# Altium project UDM.PrjPcb
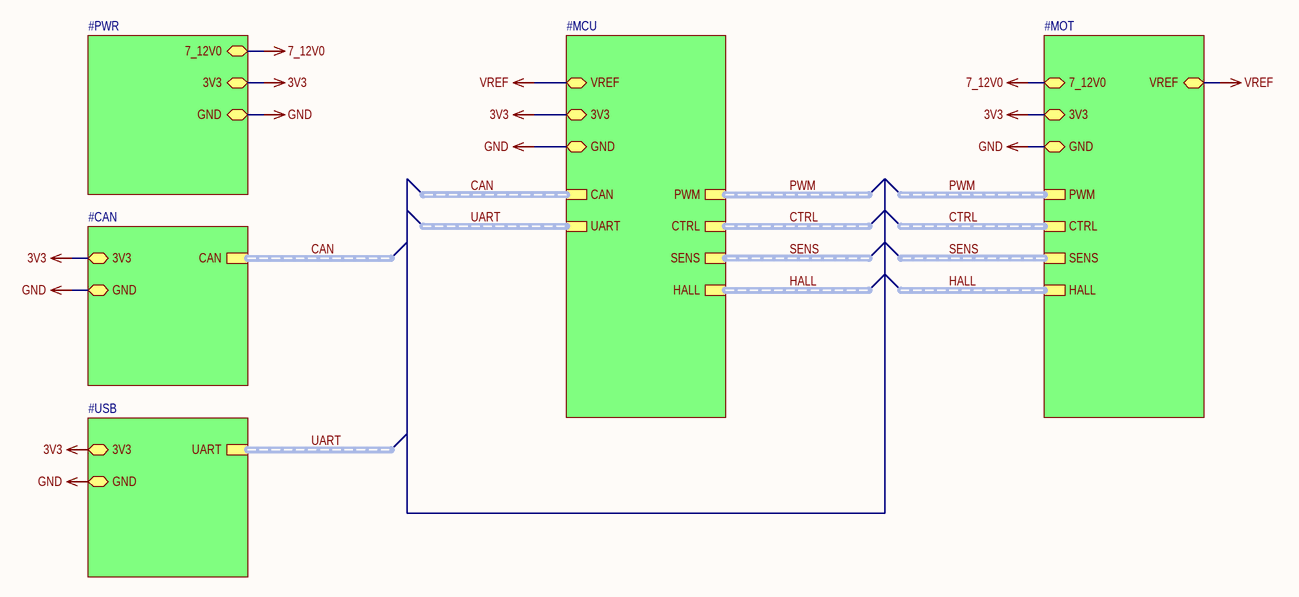
[diagram p0: top.SchDoc]
6 sheets, 102 parts. Net scope: strictly hierarchical (ports join the sheet entries above them; power ports are local).
Sheets:
  top.SchDoc
    #PWR = power.SchDoc
    #CAN = can.SchDoc
    #USB = usb.SchDoc
    #MCU = mcu.SchDoc
    #MOT = motor.SchDoc

## Sheet top.SchDoc
size A3

### Sub-sheets
#CAN = can.SchDoc: 3V3 (bidir), GND (bidir), CAN (harness UART)
#MCU = mcu.SchDoc: GND (bidir), 3V3 (bidir), CAN (harness UART), UART (harness UART), PWM (harness UART), CTRL (harness UART), SENS (harness UART), HALL (harness UART), VREF (bidir)
#MOT = motor.SchDoc: 7_12V0 (bidir), 3V3 (bidir), GND (bidir), SENS (harness UART), CTRL (harness UART), HALL (harness UART), PWM (harness UART), VREF (bidir)
#PWR = power.SchDoc: 3V3 (bidir), GND (bidir), 7_12V0 (bidir)
#USB = usb.SchDoc: 3V3 (bidir), GND (bidir), UART (harness UART)

### Nets
3V3: sheet #PWR/3V3, sheet #CAN/3V3, sheet #USB/3V3, sheet #MCU/3V3, sheet #MOT/3V3
7_12V0: sheet #PWR/7_12V0, sheet #MOT/7_12V0
GND: sheet #PWR/GND, sheet #CAN/GND, sheet #USB/GND, sheet #MCU/GND, sheet #MOT/GND
VREF: sheet #MCU/VREF, sheet #MOT/VREF

### Buses and harness runs
harness CAN = sheet #CAN/CAN
harness CAN = sheet #MCU/CAN
harness CTRL = sheet #MCU/CTRL
harness CTRL = sheet #MOT/CTRL
harness HALL = sheet #MCU/HALL
harness HALL = sheet #MOT/HALL
harness PWM = sheet #MCU/PWM
harness PWM = sheet #MOT/PWM
harness SENS = sheet #MCU/SENS
harness SENS = sheet #MOT/SENS
harness UART = sheet #MCU/UART
harness UART = sheet #USB/UART

## Sheet power.SchDoc
size A4 portrait
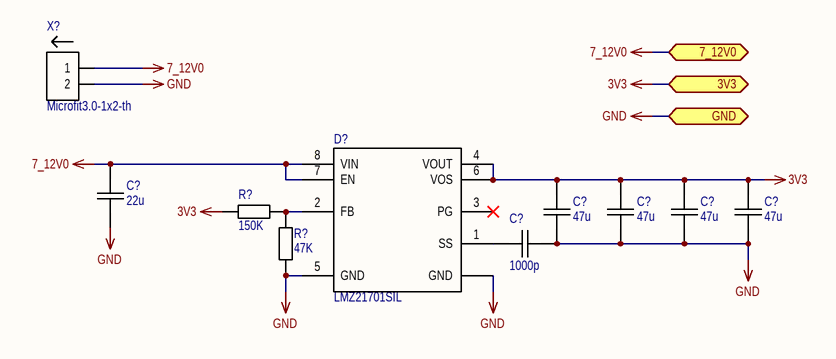
[diagram p1: power.SchDoc]

### Parts
(Parts that share a designator on the sheet are numbered #1, #2 ... from top to bottom, then left to right.)
C?#1  value 22u  [CAP-1206]  (hidden comment: CAP-22u-10%-25V-X7R-1206)
C?#2  value 47u  [CAP-0805]  (hidden comment: CAP-47u-20%-6.3V-X5R-0805)
C?#3  value 47u  [CAP-0805]  (hidden comment: CAP-47u-20%-6.3V-X5R-0805)
C?#4  value 47u  [CAP-0805]  (hidden comment: CAP-47u-20%-6.3V-X5R-0805)
C?#5  value 47u  [CAP-0805]  (hidden comment: CAP-47u-20%-6.3V-X5R-0805)
C?#6  value 1000p  [CAP-0402]  (hidden comment: CAP-1000p-5%-50V-NP0-0402)
D?#1  LMZ21701SIL  [uSIP_SIL0008E]
R?#1  value 150K  [RES-0402]  (hidden comment: RES-150K-1%-0.063-0402)
R?#2  value 47K  [RES-0402]  (hidden comment: RES-47K-1%-0.063-0402)
X?#1  Microfit3.0-1x2-th  [Microfit3.0-1x2-th]

### Ports
3V3 (bidir), 7_12V0 (bidir), GND (bidir)

### Nets
3V3: C?#2.1 C?#3.2 C?#4.2 C?#5.2 D?#1.4(VOUT) D?#1.6(VOS) R?#1.2 ; port 3V3
7_12V0: C?#1.2 D?#1.7(EN) D?#1.8(VIN) X?#1.1 ; port 7_12V0
GND: C?#1.1 C?#2.2 C?#3.1 C?#4.1 C?#5.1 C?#6.1 D?#1.5(GND) D?#1.PAD(GND) R?#2.2 X?#1.2 ; port GND
NetC?#6_2: C?#6.2 D?#1.1(SS)
NetD?#1_2: D?#1.2(FB) R?#1.1 R?#2.1

Not connected (* = marked no-connect by the designer): D?#1 3(PG)*

### Library data of the parts
C?#1 = CAP-1206: Конденсатор; Tolerance: 10; Voltage: 25; Part Number: *; Manufacturer: *; Temperature: X7R
C?#2-C?#5 = CAP-0805: Конденсатор; Tolerance: 20; Voltage: 6.3; Part Number: *; Manufacturer: *; Temperature: X5R
C?#6 = CAP-0402: Конденсатор; Tolerance: 5; Voltage: 50; Part Number: *; Manufacturer: *; Temperature: NP0
D?#1 = LMZ21701: Интегральная микросхема; Manufacturer: TI; Part Number: LMZ21701SIL
R?#1 R?#2 = RES-0402: Резистор; Tolerance: 1; Power: 0.063; Part Number: *; Manufacturer: *
X?#1 = Microfit3.0-1x2-th: Manufacturer: *; Part Number: Microfit3.0-1x2-th

## Sheet can.SchDoc
size A4 portrait
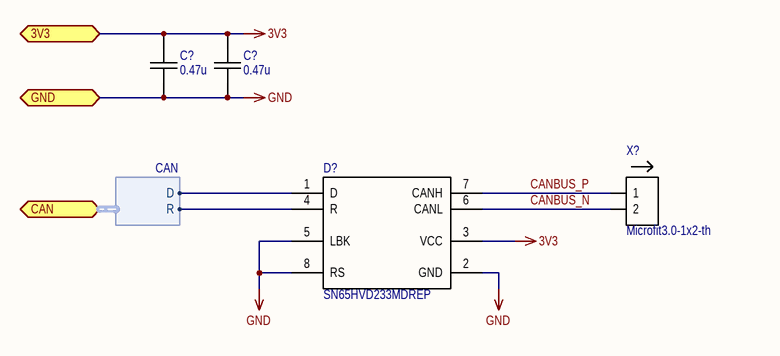
[diagram p2: can.SchDoc]

### Parts
(Parts that share a designator on the sheet are numbered #1, #2 ... from top to bottom, then left to right.)
C?#7  value 0.47u  [CAP-0402]  (hidden comment: CAP-0.47u-10%-50V-X7R-0402)
C?#8  value 0.47u  [CAP-0402]  (hidden comment: CAP-0.47u-10%-50V-X7R-0402)
D?#2  SN65HVD233MDREP  [SO-8]
X?#2  Microfit3.0-1x2-th  [Microfit3.0-1x2-th]

### Ports
3V3 (bidir), CAN (bidir, harness CAN), GND (bidir)

### Harnesses
CAN: D, R

### Nets
3V3: C?#7.2 C?#8.2 D?#2.3(VCC) ; port 3V3
GND: C?#7.1 C?#8.1 D?#2.2(GND) D?#2.5(LBK) D?#2.8(RS) ; port GND
CAN.D: D?#2.1(D) ; port CAN.D
CAN.R: D?#2.4(R) ; port CAN.R
CANBUS_N: D?#2.6(CANL) X?#2.2
CANBUS_P: D?#2.7(CANH) X?#2.1

### Library data of the parts
C?#7 C?#8 = CAP-0402: Конденсатор; Tolerance: 10; Voltage: 50; Part Number: *; Manufacturer: *; Temperature: X7R
D?#2 = SN65HVD233: Интегральная микросхема; Manufacturer: TI; Part Number: SN65HVD233MDREP
X?#2 = Microfit3.0-1x2-th: Manufacturer: *; Part Number: Microfit3.0-1x2-th

## Sheet usb.SchDoc
size A4 portrait
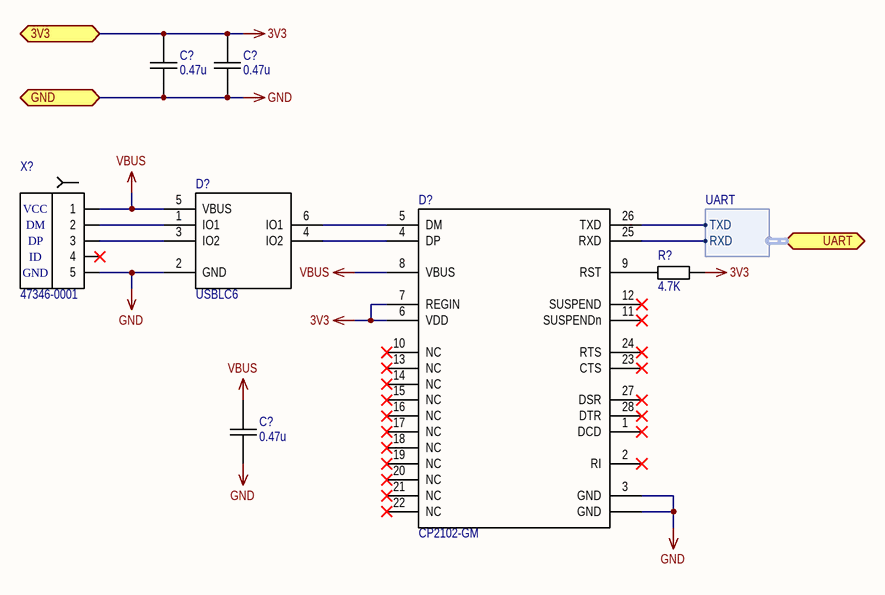
[diagram p3: usb.SchDoc]

### Parts
(Parts that share a designator on the sheet are numbered #1, #2 ... from top to bottom, then left to right.)
C?#9  value 0.47u  [CAP-0402]  (hidden comment: CAP-0.47u-10%-50V-X7R-0402)
C?#10  value 0.47u  [CAP-0402]  (hidden comment: CAP-0.47u-10%-50V-X7R-0402)
C?#11  value 0.47u  [CAP-0402]  (hidden comment: CAP-0.47u-10%-50V-X7R-0402)
D?#3  USBLC6  [SOT23-6]
D?#4  CP2102-GM  [QFN-28-5x5]
R?#3  value 4.7K  [RES-0402]  (hidden comment: RES-4.7K-1%-0.063-0402)
X?#3  47346-0001  [473460001]

### Ports
3V3 (bidir), GND (bidir), UART (bidir, harness UART)

### Harnesses
UART: TXD, RXD

### Nets
3V3: C?#9.2 C?#10.2 D?#4.6(VDD) D?#4.7(REGIN) R?#3.1 ; port 3V3
GND: C?#9.1 C?#10.1 C?#11.1 D?#3.2(GND) D?#4.3(GND) D?#4.PAD(GND) X?#3.5 ; port GND
VBUS: C?#11.2 D?#3.5(VBUS) D?#4.8(VBUS) X?#3.1
UART.RXD: D?#4.25(RXD) ; port UART.RXD
UART.TXD: D?#4.26(TXD) ; port UART.TXD
NetD?#3_1: D?#3.1(IO1) X?#3.2
NetD?#3_3: D?#3.3(IO2) X?#3.3
NetD?#3_4: D?#3.4(IO2) D?#4.4(DP)
NetD?#3_6: D?#3.6(IO1) D?#4.5(DM)
NetD?#4_9: D?#4.9(RST) R?#3.2

Not connected (* = marked no-connect by the designer): D?#4 1(DCD)* 2(RI)* 10(NC)* 11(SUSPENDn)* 12(SUSPEND)* 13(NC)* 14(NC)* 15(NC)* 16(NC)* 17(NC)* 18(NC)* 19(NC)* 20(NC)* 21(NC)* 22(NC)* 23(CTS)* 24(RTS)* 27(DSR)* 28(DTR)*; X?#3 4*

### Notes on the sheet
- (in symbol USB-Micro-B) VCC; DM; DP; ID; GND

### Library data of the parts
C?#9-C?#11 = CAP-0402: Конденсатор; Tolerance: 10; Voltage: 50; Part Number: *; Manufacturer: *; Temperature: X7R
D?#3 = USBLC6: Интегральная микросхема; Manufacturer: TI; Part Number: USBLC6
D?#4 = CP2102: Интегральная микросхема; Manufacturer: SiLabs; Part Number: CP2102-GM
R?#3 = RES-0402: Резистор; Tolerance: 1; Power: 0.063; Part Number: *; Manufacturer: *
X?#3 = USB-Micro-B: Manufacturer: Molex; Part Number: 47346-0001

## Sheet mcu.SchDoc
size A3
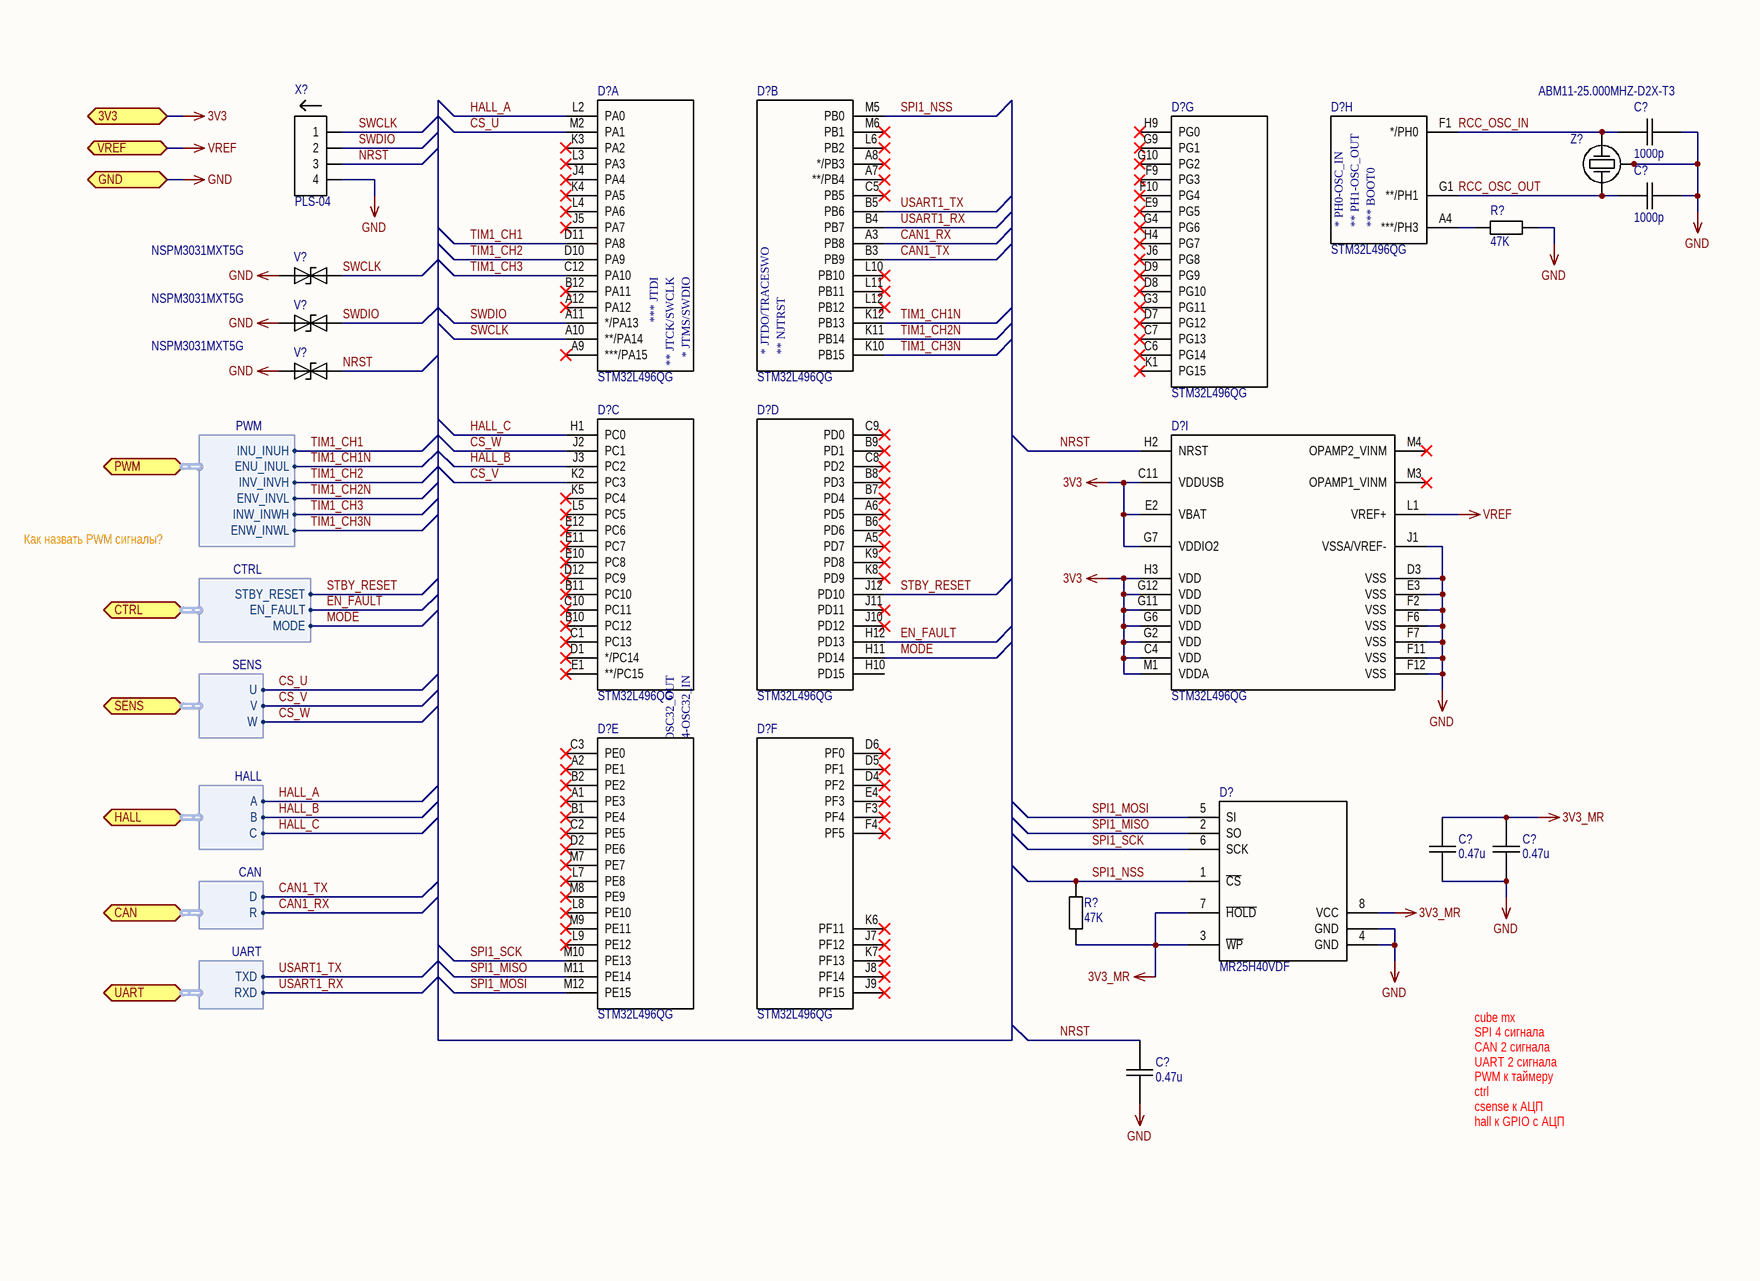
[diagram p4: mcu.SchDoc, right]

### Parts
(Parts that share a designator on the sheet are numbered #1, #2 ... from top to bottom, then left to right.)
C?#12  value 1000p  [CAP-0402]  (hidden comment: CAP-1000p-5%-50V-NP0-0402)
C?#13  value 1000p  [CAP-0402]  (hidden comment: CAP-1000p-5%-50V-NP0-0402)
C?#14  value 0.47u  [CAP-0402]  (hidden comment: CAP-0.47u-10%-50V-X7R-0402)
C?#15  value 0.47u  [CAP-0402]  (hidden comment: CAP-0.47u-10%-50V-X7R-0402)
C?#16  value 0.47u  [CAP-0402]  (hidden comment: CAP-0.47u-10%-50V-X7R-0402)
D?#5  STM32L496QG  [UFBGA132]  (part A of 9)
D?#6  STM32L496QG  [UFBGA132]  (part B of 9)
D?#7  STM32L496QG  [UFBGA132]  (part G of 9)
D?#8  STM32L496QG  [UFBGA132]  (part H of 9)
D?#9  STM32L496QG  [UFBGA132]  (part C of 9)
D?#10  STM32L496QG  [UFBGA132]  (part D of 9)
D?#11  STM32L496QG  [UFBGA132]  (part I of 9)
D?#12  STM32L496QG  [UFBGA132]  (part E of 9)
D?#13  STM32L496QG  [UFBGA132]  (part F of 9)
D?#14  MR25H40VDF  [DFN-8-5x6-SMALL_FLAG - duplicate]
R?#4  value 47K  [RES-0402]  (hidden comment: RES-47K-1%-0.063-0402)
R?#5  value 47K  [RES-0402]  (hidden comment: RES-47K-1%-0.063-0402)
V?#1  NSPM3031MXT5G  [X2DFN-2]
V?#2  NSPM3031MXT5G  [X2DFN-2]
V?#3  NSPM3031MXT5G  [X2DFN-2]
X?#4  PLS-04  [PLS-04]
Z?  ABM11-25.000MHZ-D2X-T3  [ABM11]

### Ports
3V3 (bidir), CAN (bidir, harness CAN), CTRL (bidir, harness CTRL), GND (bidir), HALL (bidir, harness HALL), PWM (bidir, harness PWM), SENS (bidir, harness SENS), UART (bidir, harness UART), VREF (bidir)

### Harnesses
CTRL: STBY_RESET, EN_FAULT, MODE
SENS: U, V, W
HALL: A, B, C
CAN: D, R
UART: TXD, RXD
PWM: INU_INUH, ENU_INUL, INV_INVH, ENV_INVL, INW_INWH, ENW_INWL

### Nets
3V3: D?#11.C4(VDD) D?#11.C11(VDDUSB) D?#11.E2(VBAT) D?#11.G2(VDD) D?#11.G6(VDD) D?#11.G7(VDDIO2) D?#11.G11(VDD) D?#11.G12(VDD) D?#11.H3(VDD) D?#11.M1(VDDA) ; port 3V3
3V3_MR: C?#14.2 C?#15.2 D?#14.3(~{WP}) D?#14.7(~{HOLD}) D?#14.8(VCC) R?#5.1
GND: C?#12.2 C?#13.2 C?#14.1 C?#15.1 C?#16.1 D?#11.D3(VSS) D?#11.E3(VSS) D?#11.F2(VSS) D?#11.F6(VSS) D?#11.F7(VSS) D?#11.F11(VSS) D?#11.F12(VSS) D?#11.J1(VSSA/VREF-) D?#14.4(GND) D?#14.PAD(GND) R?#4.2 V?#1.1 V?#2.1 V?#3.1 X?#4.4 Z?.2 Z?.4 ; port GND
VREF: D?#11.L1(VREF+) ; port VREF
CAN1_RX: D?#6.A3(PB8) ; port CAN.R  [project net CAN.R]
CAN1_TX: D?#6.B3(PB9) ; port CAN.D  [project net CAN.D]
CS_U: D?#5.M2(PA1) ; port SENS.U  [project net SENS.U]
CS_V: D?#9.K2(PC3) ; port SENS.V  [project net SENS.V]
CS_W: D?#9.J2(PC1) ; port SENS.W  [project net SENS.W]
EN_FAULT: D?#10.H12(PD13) ; port CTRL.EN_FAULT  [project net CTRL.EN_FAULT]
HALL_A: D?#5.L2(PA0) ; port HALL.A  [project net HALL.A]
HALL_B: D?#9.J3(PC2) ; port HALL.B  [project net HALL.B]
HALL_C: D?#9.H1(PC0) ; port HALL.C  [project net HALL.C]
MODE: D?#10.H11(PD14) ; port CTRL.MODE  [project net CTRL.MODE]
NRST: C?#16.2 D?#11.H2(NRST) V?#3.2 X?#4.3
RCC_OSC_IN: C?#12.1 D?#8.F1(*/PH0) Z?.3
RCC_OSC_OUT: C?#13.1 D?#8.G1(**/PH1) Z?.1
SPI1_MISO: D?#12.M11(PE14) D?#14.2(SO)
SPI1_MOSI: D?#12.M12(PE15) D?#14.5(SI)
SPI1_NSS: D?#6.M5(PB0) D?#14.1(~{CS}) R?#5.2
SPI1_SCK: D?#12.M10(PE13) D?#14.6(SCK)
STBY_RESET: D?#10.J12(PD10) ; port CTRL.STBY_RESET  [project net CTRL.STBY_RESET]
SWCLK: D?#5.A10(**/PA14) V?#1.2 X?#4.1
SWDIO: D?#5.A11(*/PA13) V?#2.2 X?#4.2
TIM1_CH1: D?#5.D11(PA8) ; port PWM.INU_INUH  [project net PWM.INU_INUH]
TIM1_CH1N: D?#6.K12(PB13) ; port PWM.ENU_INUL  [project net PWM.ENU_INUL]
TIM1_CH2: D?#5.D10(PA9) ; port PWM.INV_INVH  [project net PWM.INV_INVH]
TIM1_CH2N: D?#6.K11(PB14) ; port PWM.ENV_INVL  [project net PWM.ENV_INVL]
TIM1_CH3: D?#5.C12(PA10) ; port PWM.INW_INWH  [project net PWM.INW_INWH]
TIM1_CH3N: D?#6.K10(PB15) ; port PWM.ENW_INWL  [project net PWM.ENW_INWL]
USART1_RX: D?#6.B4(PB7) ; port UART.RXD  [project net UART.RXD]
USART1_TX: D?#6.B5(PB6) ; port UART.TXD  [project net UART.TXD]
NetD?#8_A4: D?#8.A4(***/PH3) R?#4.1

Not connected (* = marked no-connect by the designer): D?#5 A9(***/PA15)* A12(PA12)* B12(PA11)* J4(PA4)* J5(PA7)* K3(PA2)* K4(PA5)* L3(PA3)* L4(PA6)*; D?#6 A7(**/PB4)* A8(*/PB3)* C5(PB5)* L6(PB2)* L10(PB10)* L11(PB11)* L12(PB12)* M6(PB1)*; D?#7 C6(PG14)* C7(PG13)* D7(PG12)* D8(PG10)* D9(PG9)* E9(PG5)* F9(PG3)* F10(PG4)* G3(PG11)* G4(PG6)* G9(PG1)* G10(PG2)* H4(PG7)* H9(PG0)* J6(PG8)* K1(PG15)*; D?#9 B10(PC12)* B11(PC10)* C1(PC13)* C10(PC11)* D1(*/PC14)* D12(PC9)* E1(**/PC15)* E10(PC8)* E11(PC7)* E12(PC6)* K5(PC4)* L5(PC5)*; D?#10 A5(PD7)* A6(PD5)* B6(PD6)* B7(PD4)* B8(PD3)* B9(PD1)* C8(PD2)* C9(PD0)* H10(PD15) J10(PD12)* J11(PD11)* K8(PD9)* K9(PD8)*; D?#11 M3(OPAMP1_VINM)* M4(OPAMP2_VINM)*; D?#12 A1(PE3)* A2(PE1)* B1(PE4)* B2(PE2)* C2(PE5)* C3(PE0)* D2(PE6)* L7(PE8)* L8(PE10)* L9(PE12)* M7(PE7)* M8(PE9)* M9(PE11)*; D?#13 D4(PF2)* D5(PF1)* D6(PF0)* E4(PF3)* F3(PF4)* F4(PF5)* J7(PF12)* J8(PF14)* J9(PF15)* K6(PF11)* K7(PF13)*

### Notes on the sheet
- Как назвать PWM сигналы?
- cube mx
  SPI 4 сигнала
  CAN 2 сигнала
  UART 2 сигнала
  PWM к таймеру
  ctrl
  csense к АЦП
  hall к GPIO с АЦП
- (in symbol STM32L496QG, part A) *** JTDI; ** JTCK/SWCLK; * JTMS/SWDIO
- (in symbol STM32L496QG, part B) * JTDO/TRACESWO; ** NJTRST
- (in symbol STM32L496QG, part C) ** PC15-OSC32_OUT; * PC14-OSC32_IN
- (in symbol STM32L496QG, part H) * PH0-OSC_IN; ** PH1-OSC_OUT; *** BOOT0

### Library data of the parts
C?#12 C?#13 = CAP-0402: Конденсатор; Tolerance: 5; Voltage: 50; Part Number: *; Manufacturer: *; Temperature: NP0
C?#14-C?#16 = CAP-0402: Конденсатор; Tolerance: 10; Voltage: 50; Part Number: *; Manufacturer: *; Temperature: X7R
D?#5-D?#13 = STM32L496QG: Интегральная микросхема; Manufacturer: ST; Part Number: STM32L496QG
D?#14 = MR25H40: Интегральная микросхема, SPI MRAM; Manufacturer: Everspin; Part Number: MR25H40VDF
R?#4 R?#5 = RES-0402: Резистор; Tolerance: 1; Power: 0.063; Part Number: *; Manufacturer: *
V?#1-V?#3 = NSPM3031: Диод подавления ESD; Manufacturer: *; Tolerance: *; Power: *; Part Number: NSPM3031MXT5G
Z? = ABM11-25MHZ: Резонатор кварцевый; Value: *; Manufacturer: *; Tolerance: *; Part Number: ABM11-25.000MHZ-D2X-T3
X?#4 = PLS-04: Manufacturer: *; Part Number: PLS-04

## Sheet motor.SchDoc
size A3
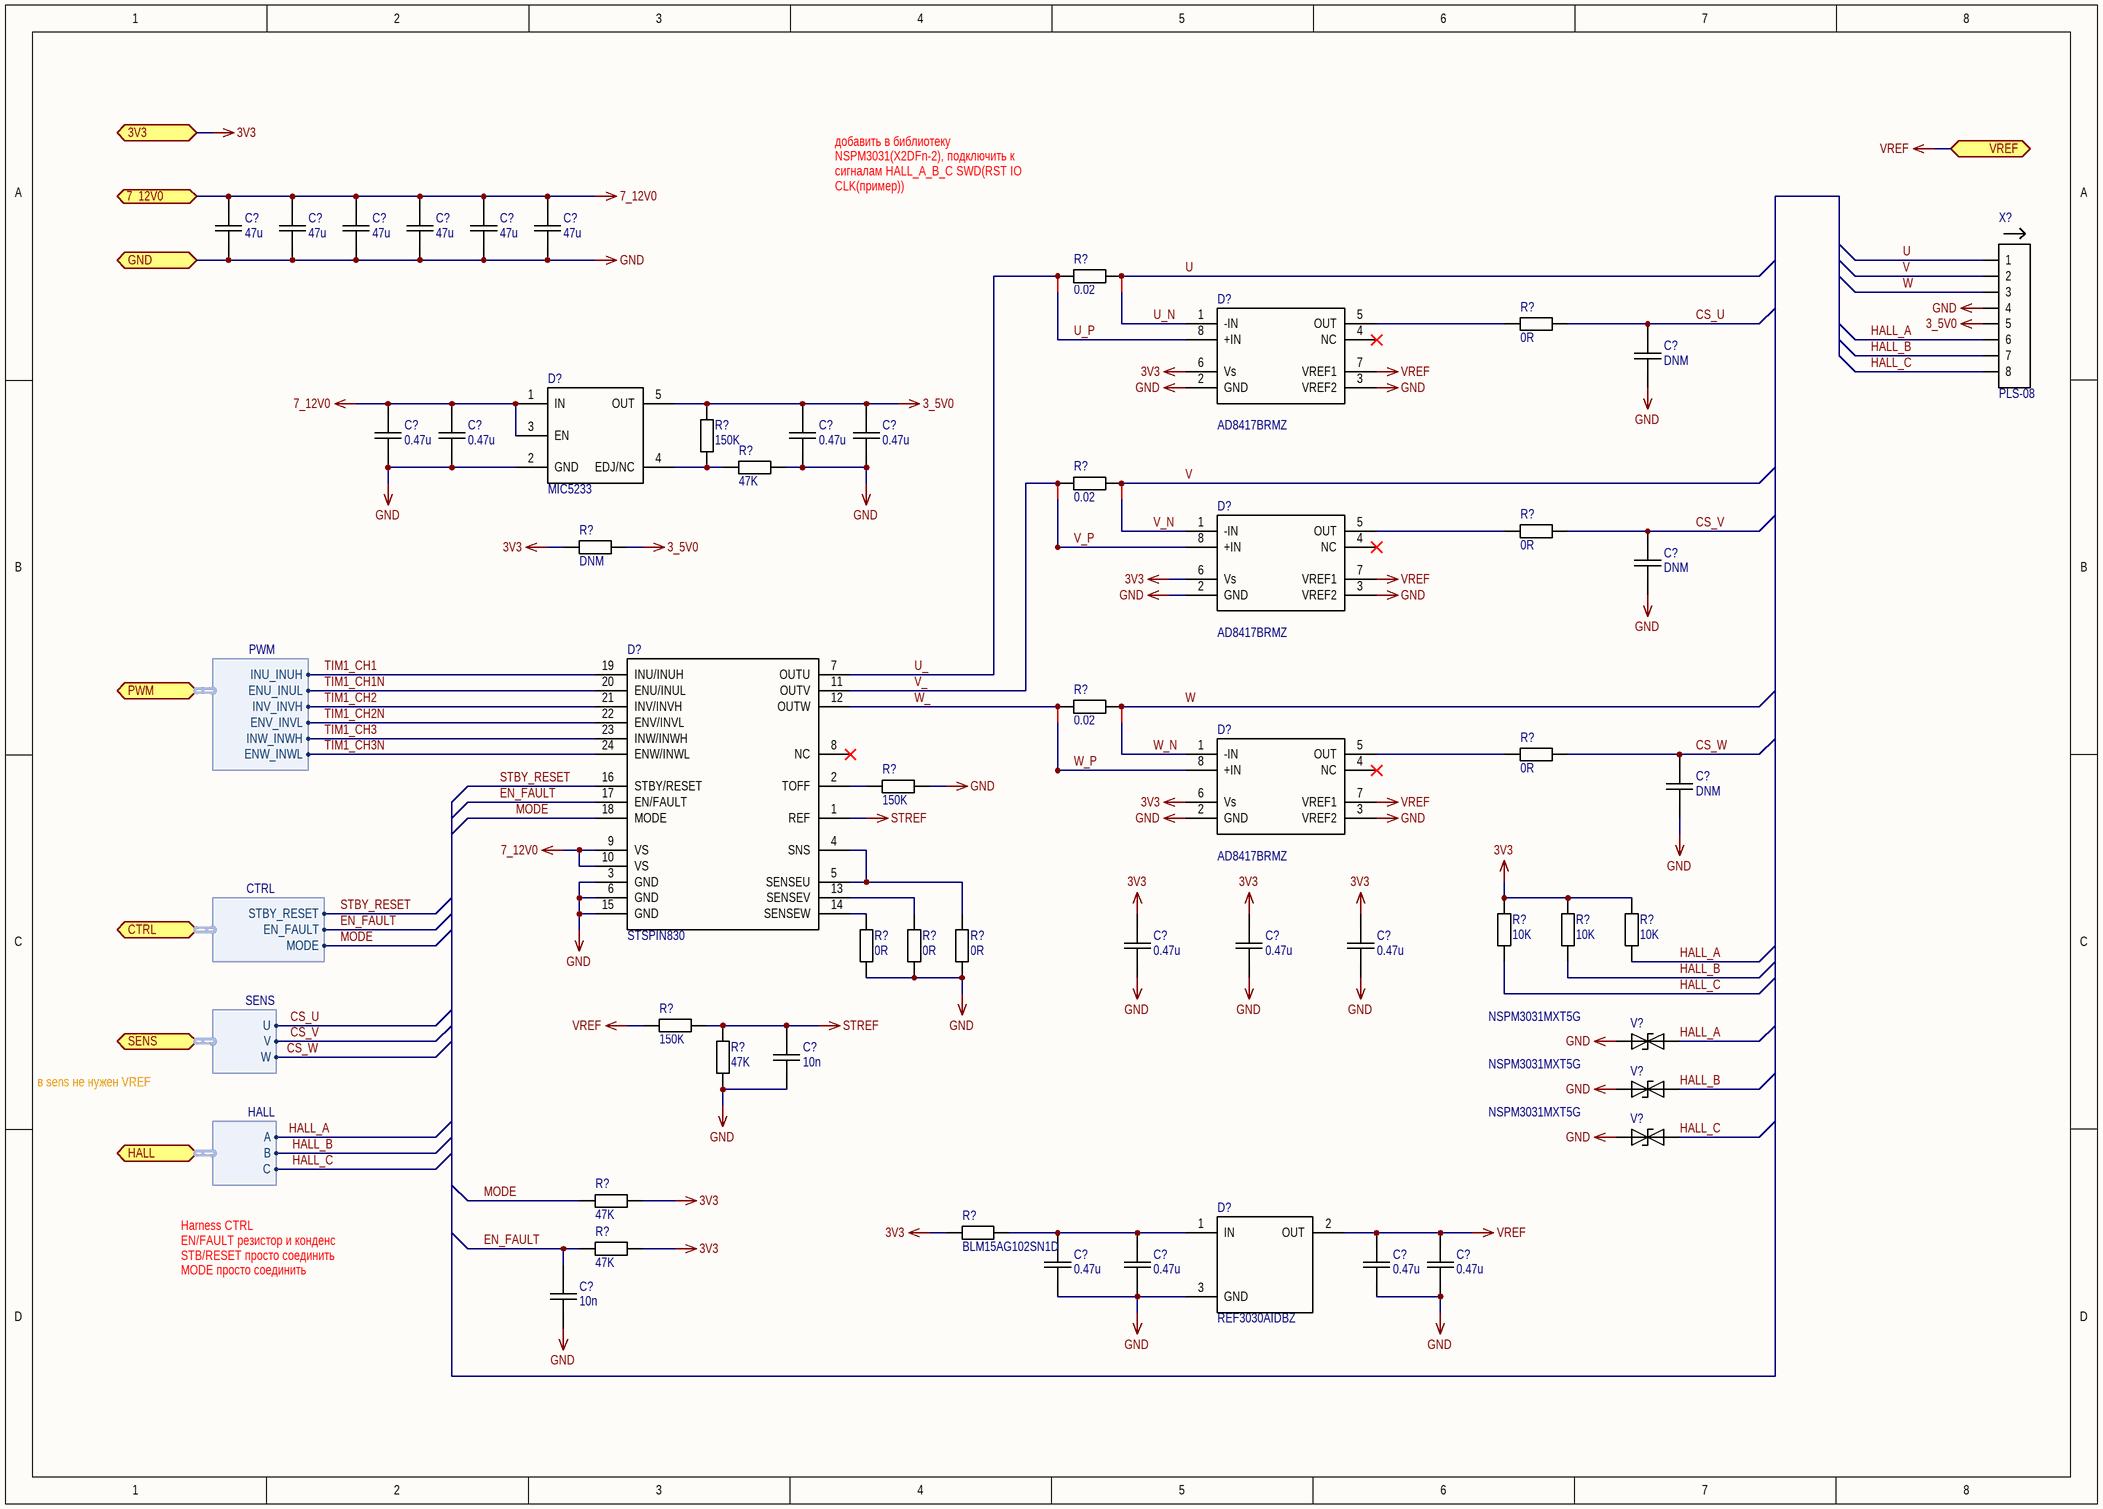
[diagram p5: motor.SchDoc]

### Parts
(Parts that share a designator on the sheet are numbered #1, #2 ... from top to bottom, then left to right.)
C?#17  value 47u  [CAP-1206]  (hidden comment: CAP-47u-20%-25V-X7R-1206)
C?#18  value 47u  [CAP-1206]  (hidden comment: CAP-47u-20%-25V-X7R-1206)
C?#19  value 47u  [CAP-1206]  (hidden comment: CAP-47u-20%-25V-X7R-1206)
C?#20  value 47u  [CAP-1206]  (hidden comment: CAP-47u-20%-25V-X7R-1206)
C?#21  value 47u  [CAP-1206]  (hidden comment: CAP-47u-20%-25V-X7R-1206)
C?#22  value 47u  [CAP-1206]  (hidden comment: CAP-47u-20%-25V-X7R-1206)
C?#23  value DNM  [CAP-0402]  (hidden comment: CAP-DNM-10%-50V-X7R-0402)
C?#24  value 0.47u  [CAP-0402]  (hidden comment: CAP-0.47u-10%-50V-X7R-0402)
C?#25  value 0.47u  [CAP-0402]  (hidden comment: CAP-0.47u-10%-50V-X7R-0402)
C?#26  value 0.47u  [CAP-0402]  (hidden comment: CAP-0.47u-10%-50V-X7R-0402)
C?#27  value 0.47u  [CAP-0402]  (hidden comment: CAP-0.47u-10%-50V-X7R-0402)
C?#28  value DNM  [CAP-0402]  (hidden comment: CAP-DNM-10%-50V-X7R-0402)
C?#29  value DNM  [CAP-0402]  (hidden comment: CAP-DNM-10%-50V-X7R-0402)
C?#30  value 0.47u  [CAP-0402]  (hidden comment: CAP-0.47u-10%-50V-X7R-0402)
C?#31  value 0.47u  [CAP-0402]  (hidden comment: CAP-0.47u-10%-50V-X7R-0402)
C?#32  value 0.47u  [CAP-0402]  (hidden comment: CAP-0.47u-10%-50V-X7R-0402)
C?#33  value 10n  [CAP-0402]  (hidden comment: CAP-10n-10%-50V-X7R-0402)
C?#34  value 0.47u  [CAP-0402]  (hidden comment: CAP-0.47u-10%-50V-X7R-0402)
C?#35  value 0.47u  [CAP-0402]  (hidden comment: CAP-0.47u-10%-50V-X7R-0402)
C?#36  value 0.47u  [CAP-0402]  (hidden comment: CAP-0.47u-10%-50V-X7R-0402)
C?#37  value 0.47u  [CAP-0402]  (hidden comment: CAP-0.47u-10%-50V-X7R-0402)
C?#38  value 10n  [CAP-0402]  (hidden comment: CAP-10n-10%-50V-X7R-0402)
D?#15  AD8417BRMZ  [MSOP-8]
D?#16  MIC5233  [SOT-23-5]
D?#17  AD8417BRMZ  [MSOP-8]
D?#18  STSPIN830  [QFN-24-4X4]
D?#19  AD8417BRMZ  [MSOP-8]
D?#20  REF3030AIDBZ  [SOT-23-3]
NT?#1  Net_tie  [Net_tie]  (value not drawn)  (net tie, no BOM)
NT?#2  Net_tie  [Net_tie]  (value not drawn)  (net tie, no BOM)
NT?#3  Net_tie  [Net_tie]  (value not drawn)  (net tie, no BOM)
NT?#4  Net_tie  [Net_tie]  (value not drawn)  (net tie, no BOM)
NT?#5  Net_tie  [Net_tie]  (value not drawn)  (net tie, no BOM)
NT?#6  Net_tie  [Net_tie]  (value not drawn)  (net tie, no BOM)
R?#6  value 0.02  [RES-0402]  (hidden comment: RES-0.02-1%-0.063-0402)
R?#7  value 0R  [RES-0402]  (hidden comment: RES-0R-1%-0.063-0402)
R?#8  value 150K  [RES-0402]  (hidden comment: RES-150K-1%-0.063-0402)
R?#9  value 47K  [RES-0402]  (hidden comment: RES-47K-1%-0.063-0402)
R?#10  value 0.02  [RES-0402]  (hidden comment: RES-0.02-1%-0.063-0402)
R?#11  value 0R  [RES-0402]  (hidden comment: RES-0R-1%-0.063-0402)
R?#12  value DNM  [RES-0402]  (hidden comment: RES-DNM-1%-0.063-0402)
R?#13  value 0.02  [RES-0402]  (hidden comment: RES-0.02-1%-0.063-0402)
R?#14  value 0R  [RES-0402]  (hidden comment: RES-0R-1%-0.063-0402)
R?#15  value 150K  [RES-0402]  (hidden comment: RES-150K-1%-0.063-0402)
R?#16  value 10K  [RES-0402]  (hidden comment: RES-10K-1%-0.063-0402)
R?#17  value 10K  [RES-0402]  (hidden comment: RES-10K-1%-0.063-0402)
R?#18  value 10K  [RES-0402]  (hidden comment: RES-10K-1%-0.063-0402)
R?#19  value 0R  [RES-0402]  (hidden comment: RES-0R-1%-0.063-0402)
R?#20  value 0R  [RES-0402]  (hidden comment: RES-0R-1%-0.063-0402)
R?#21  value 0R  [RES-0402]  (hidden comment: RES-0R-1%-0.063-0402)
R?#22  value 150K  [RES-0402]  (hidden comment: RES-150K-1%-0.063-0402)
R?#23  value 47K  [RES-0402]  (hidden comment: RES-47K-1%-0.063-0402)
R?#24  value 47K  [RES-0402]  (hidden comment: RES-47K-1%-0.063-0402)
R?#25  BLM15AG102SN1D  [BLM15]
R?#26  value 47K  [RES-0402]  (hidden comment: RES-47K-1%-0.063-0402)
V?#4  NSPM3031MXT5G  [X2DFN-2]
V?#5  NSPM3031MXT5G  [X2DFN-2]
V?#6  NSPM3031MXT5G  [X2DFN-2]
X?#5  PLS-08  [PLS-08]

### Ports
3V3 (bidir), 7_12V0 (bidir), CTRL (bidir, harness CTRL), GND (bidir), HALL (bidir, harness HALL), PWM (bidir, harness PWM), SENS (bidir, harness SENS), VREF (bidir)

### Harnesses
SENS: U, V, W
HALL: A, B, C
PWM: INU_INUH, ENU_INUL, INV_INVH, ENV_INVL, INW_INWH, ENW_INWL
CTRL: STBY_RESET, EN_FAULT, MODE

### Nets
3_5V0: C?#26.2 C?#27.2 D?#16.5(OUT) R?#8.2 R?#12.1 X?#5.5
3V3: C?#30.2 C?#31.2 C?#32.2 D?#15.6(Vs) D?#17.6(Vs) D?#19.6(Vs) R?#12.2 R?#16.2 R?#17.2 R?#18.2 R?#24.2 R?#25.1 R?#26.2 ; port 3V3
7_12V0: C?#17.2 C?#18.2 C?#19.2 C?#20.2 C?#21.2 C?#22.2 C?#24.2 C?#25.2 D?#16.1(IN) D?#16.3(EN) D?#18.9(VS) D?#18.10(VS) ; port 7_12V0
GND: C?#17.1 C?#18.1 C?#19.1 C?#20.1 C?#21.1 C?#22.1 C?#23.1 C?#24.1 C?#25.1 C?#26.1 C?#27.1 C?#28.1 C?#29.1 C?#30.1 C?#31.1 C?#32.1 C?#33.1 C?#34.1 C?#35.1 C?#36.1 C?#37.1 C?#38.1 D?#15.2(GND) D?#15.3(VREF2) D?#16.2(GND) D?#17.2(GND) D?#17.3(VREF2) D?#18.3(GND) D?#18.6(GND) D?#18.15(GND) D?#19.2(GND) D?#19.3(VREF2) D?#20.3(GND) R?#9.2 R?#15.1 R?#19.1 R?#20.1 R?#21.1 R?#23.1 V?#4.1 V?#5.1 V?#6.1 X?#5.4 ; port GND
STREF: C?#33.2 D?#18.1(REF) R?#22.2 R?#23.2
VREF: C?#36.2 C?#37.2 D?#15.7(VREF1) D?#17.7(VREF1) D?#19.7(VREF1) D?#20.2(OUT) R?#22.1 ; port VREF
CS_U: C?#23.2 R?#7.2 ; port SENS.U  [project net SENS.U]
CS_V: C?#28.2 R?#11.2 ; port SENS.V  [project net SENS.V]
CS_W: C?#29.2 R?#14.2 ; port SENS.W  [project net SENS.W]
EN_FAULT: C?#38.2 D?#18.17(EN/FAULT) R?#26.1 ; port CTRL.EN_FAULT  [project net CTRL.EN_FAULT]
HALL_A: R?#18.1 V?#4.2 X?#5.6 ; port HALL.A  [project net HALL.A]
HALL_B: R?#17.1 V?#5.2 X?#5.7 ; port HALL.B  [project net HALL.B]
HALL_C: R?#16.1 V?#6.2 X?#5.8 ; port HALL.C  [project net HALL.C]
MODE: D?#18.18(MODE) R?#24.1 ; port CTRL.MODE  [project net CTRL.MODE]
STBY_RESET: D?#18.16(STBY/RESET) ; port CTRL.STBY_RESET  [project net CTRL.STBY_RESET]
TIM1_CH1: D?#18.19(INU/INUH) ; port PWM.INU_INUH  [project net PWM.INU_INUH]
TIM1_CH1N: D?#18.20(ENU/INUL) ; port PWM.ENU_INUL  [project net PWM.ENU_INUL]
TIM1_CH2: D?#18.21(INV/INVH) ; port PWM.INV_INVH  [project net PWM.INV_INVH]
TIM1_CH2N: D?#18.22(ENV/INVL) ; port PWM.ENV_INVL  [project net PWM.ENV_INVL]
TIM1_CH3: D?#18.23(INW/INWH) ; port PWM.INW_INWH  [project net PWM.INW_INWH]
TIM1_CH3N: D?#18.24(ENW/INWL) ; port PWM.ENW_INWL  [project net PWM.ENW_INWL]
U: NT?#2.2 R?#6.2 X?#5.1
U_: D?#18.7(OUTU) NT?#1.2 R?#6.1
U_N: D?#15.1(-IN) NT?#2.1
U_P: D?#15.8(+IN) NT?#1.1
V: NT?#4.2 R?#10.2 X?#5.2
V_: D?#18.11(OUTV) NT?#3.2 R?#10.1
V_N: D?#17.1(-IN) NT?#4.1
V_P: D?#17.8(+IN) NT?#3.1
W: NT?#6.2 R?#13.2 X?#5.3
W_: D?#18.12(OUTW) NT?#5.2 R?#13.1
W_N: D?#19.1(-IN) NT?#6.1
W_P: D?#19.8(+IN) NT?#5.1
NetC?#34_2: C?#34.2 C?#35.2 D?#20.1(IN) R?#25.2
NetD?#15_5: D?#15.5(OUT) R?#7.1
NetD?#16_4: D?#16.4(EDJ/NC) R?#8.1 R?#9.1
NetD?#17_5: D?#17.5(OUT) R?#11.1
NetD?#18_2: D?#18.2(TOFF) R?#15.2
NetD?#18_4: D?#18.4(SNS) D?#18.5(SENSEU) R?#21.2
NetD?#18_13: D?#18.13(SENSEV) R?#20.2
NetD?#18_14: D?#18.14(SENSEW) R?#19.2
NetD?#19_5: D?#19.5(OUT) R?#14.1

Not connected (* = marked no-connect by the designer): D?#15 4(NC)*; D?#17 4(NC)*; D?#18 8(NC)*; D?#19 4(NC)*

### Buses and harness runs
bus 

### Notes on the sheet
- добавить в библиотеку NSPM3031(X2DFn-2), подключить к сигналам HALL_A_B_C SWD(RST IO CLK(пример))
- в sens не нужен VREF
- Harness CTRL
  EN/FAULT резистор и конденс
  STB/RESET просто соединить
  MODE просто соединить

### Library data of the parts
C?#17-C?#22 = CAP-1206: Конденсатор; Tolerance: 20; Voltage: 25; Part Number: *; Manufacturer: *; Temperature: X7R
C?#23-C?#38 = CAP-0402: Конденсатор; Tolerance: 10; Voltage: 50; Part Number: *; Manufacturer: *; Temperature: X7R
D?#15 D?#17 D?#19 = AD8417BRMZ: Интегральная микросхема; Manufacturer: TI; Part Number: AD8417BRMZ
D?#16 = MIC5233: Интегральная микросхема; Manufacturer: Microchip; Part Number: MIC5233
D?#18 = STSPIN830: Интегральная микросхема; Manufacturer: SiLabs; Part Number: STSPIN830
D?#20 = REF3030: Интегральная микросхема; Manufacturer: TI; Part Number: REF3030AIDBZ
NT?#1-NT?#6 = Net_tie: Короткое замыкание
R?#6-R?#24 R?#26 = RES-0402: Резистор; Tolerance: 1; Power: 0.063; Part Number: *; Manufacturer: *
R?#25 = BLM15AG102: Феррит; Manufacturer: *; Part Number: BLM15AG102SN1D
V?#4-V?#6 = NSPM3031: Диод подавления ESD; Manufacturer: *; Tolerance: *; Power: *; Part Number: NSPM3031MXT5G
X?#5 = PLS-08: Manufacturer: *; Part Number: PLS-08

## Nets that join several sheets
3V3: power (7 pins), can (C?#7.2 C?#8.2 D?#2.3), usb (5 pins), mcu (10 pins), motor (13 pins)
7_12V0: power (C?#1.2 D?#1.7 D?#1.8 X?#1.1), motor (12 pins)
GND: power (10 pins), can (5 pins), usb (7 pins), mcu (22 pins), motor (43 pins)
VREF: mcu (D?#11.L1), motor (7 pins)
CAN.D: can (D?#2.1), mcu (D?#6.B3)
CAN.R: can (D?#2.4), mcu (D?#6.A3)
CTRL.EN_FAULT: mcu (D?#10.H12), motor (C?#38.2 D?#18.17 R?#26.1)
CTRL.MODE: mcu (D?#10.H11), motor (D?#18.18 R?#24.1)
CTRL.STBY_RESET: mcu (D?#10.J12), motor (D?#18.16)
HALL.A: mcu (D?#5.L2), motor (R?#18.1 V?#4.2 X?#5.6)
HALL.B: mcu (D?#9.J3), motor (R?#17.1 V?#5.2 X?#5.7)
HALL.C: mcu (D?#9.H1), motor (R?#16.1 V?#6.2 X?#5.8)
PWM.ENU_INUL: mcu (D?#6.K12), motor (D?#18.20)
PWM.ENV_INVL: mcu (D?#6.K11), motor (D?#18.22)
PWM.ENW_INWL: mcu (D?#6.K10), motor (D?#18.24)
PWM.INU_INUH: mcu (D?#5.D11), motor (D?#18.19)
PWM.INV_INVH: mcu (D?#5.D10), motor (D?#18.21)
PWM.INW_INWH: mcu (D?#5.C12), motor (D?#18.23)
SENS.U: mcu (D?#5.M2), motor (C?#23.2 R?#7.2)
SENS.V: mcu (D?#9.K2), motor (C?#28.2 R?#11.2)
SENS.W: mcu (D?#9.J2), motor (C?#29.2 R?#14.2)
UART.RXD: usb (D?#4.25), mcu (D?#6.B4)
UART.TXD: usb (D?#4.26), mcu (D?#6.B5)